# EAGLE design HumidityModule (EAGLE 5.10)
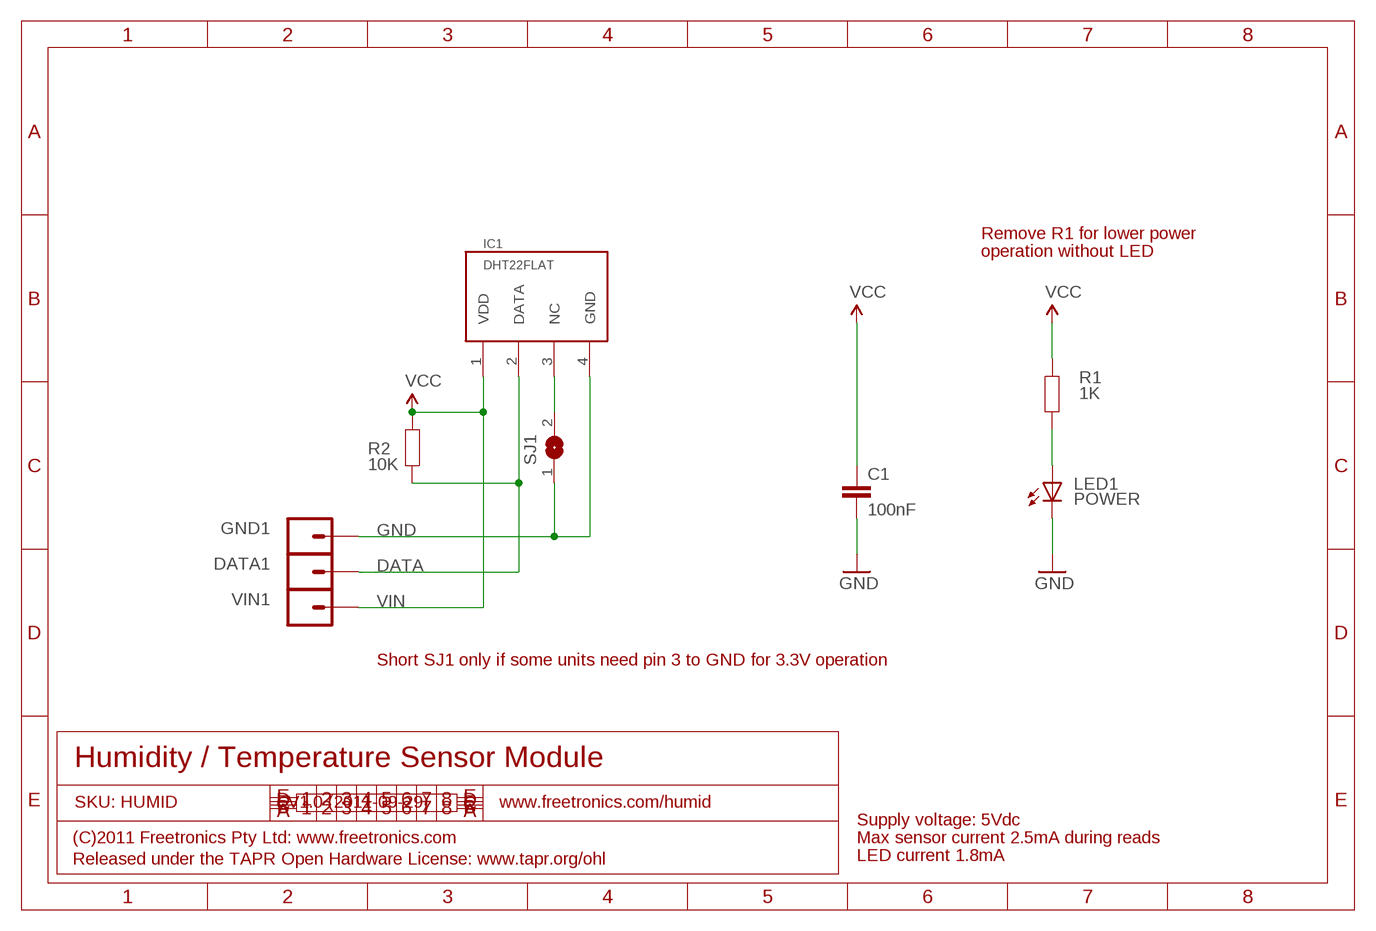
[diagram p0: schematic, sheet 1]

## Parts
C1  100nF  CAP0603  [0603]
DATA1  M01PTH  [1X01]
GND1  M01PTH  [1X01]
IC1  DHT22FLAT  [DHT22]
LED1  POWER  LED0603  [LED-0603]
R1  1K  RESISTOR0603  [0603]
R2  10K  RESISTOR0603  [0603]
SJ1  SJ  [SJ]
VIN1  M01PTH  [1X01]

## Nets
DATA: DATA1.1 IC1.2(DATA) R2.2
GND: C1.2 GND1.1 IC1.4(GND) LED1.C SJ1.1
N$1: LED1.A R1.1
N$2: IC1.3(NC) SJ1.2
VIN: C1.1 IC1.1(VDD) R1.2 R2.1 VIN1.1 ; supply symbol labelled VCC

## Notes on the sheet
- Remove R1 for lower power
- operation without LED
- Short SJ1 only if some units need pin 3 to GND for 3.3V operation
- Humidity / Temperature Sensor Module
- SKU: HUMID | V1.0 (2011-09-29) | www.freetronics.com/humid
- Supply voltage: 5Vdc
- (C)2011 Freetronics Pty Ltd: www.freetronics.com | Max sensor current 2.5mA during reads
- Released under the TAPR Open Hardware License: www.tapr.org/ohl | LED current 1.8mA

## Library data of the parts
C1 = freetronics-master-v1:CAP: Capacitor Standard 0603 ceramic capacitor, and 0.1" leaded capacitor.
DATA1 GND1 VIN1 = freetronics-master-v1:M01: Header 1 Standard 1-pin 0.1" header. Use with straight break away headers (SKU : PRT-00116), right angle break away headers (PRT-00553), swiss pins (PRT-00743), machine pins (PRT-00117), and female headers (PRT-00115).
IC1 = freetronics-jon:DHT22
LED1 = freetronics-marc:LED: LEDs Standard schematic elements and footprints for 5mm, 3mm, 1206, and 0603 sized LEDs. 5mm - Spark Fun Electronics SKU : COM-00529 (and others)
R1 R2 = freetronics-master-v1:RESISTOR: Resistor Basic schematic elements and footprints for 0603, 1206, and PTH 1/10th watt (small) resistors.
SJ1 = freetronics-master-v1:SJ: SMD solder JUMPER

## Board
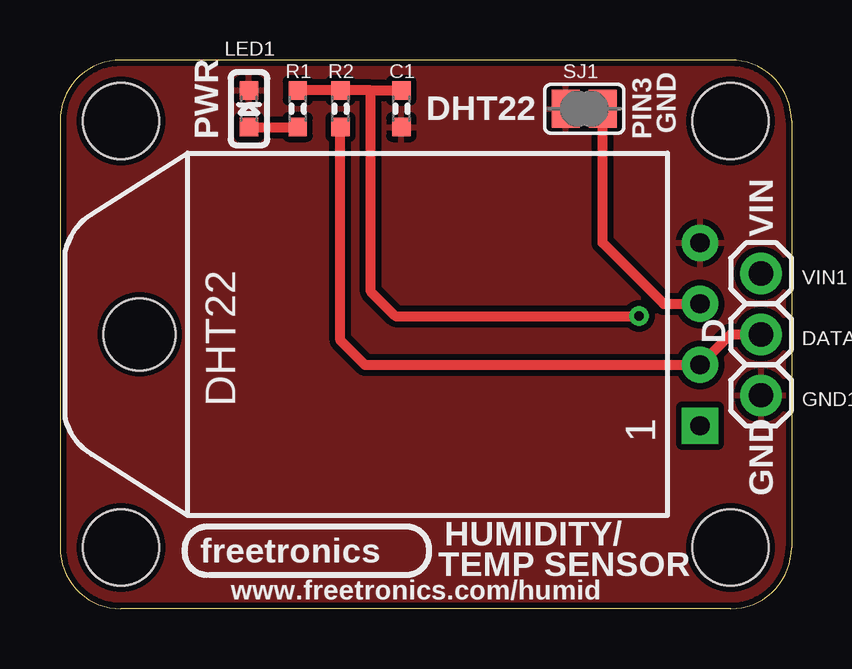
[diagram p1: board, top side]
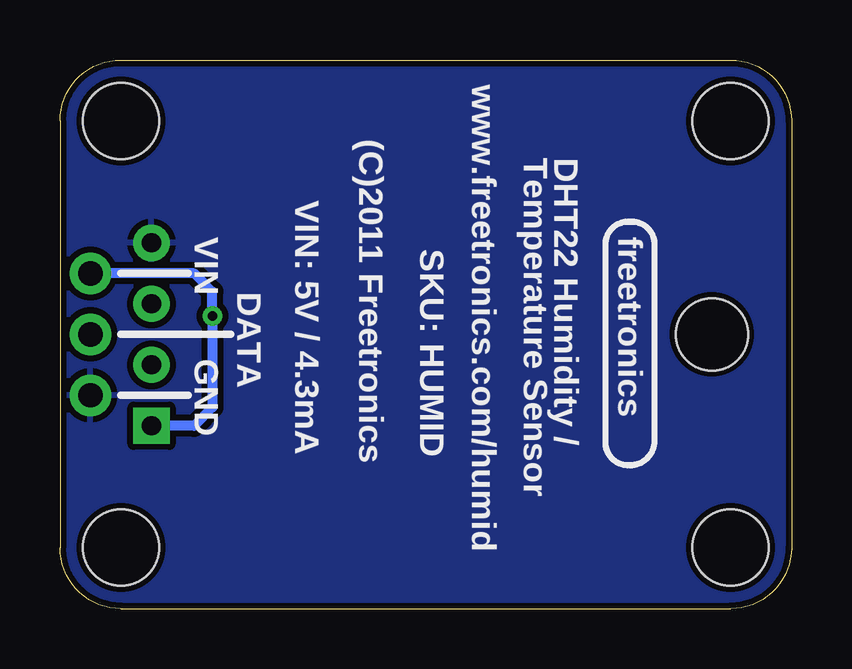
[diagram p2: board, bottom side, seen from below]

Size 30.48 x 22.86 mm. Coordinates in mm from the lower left corner, seen from the top.
Outline: 2.54,22.86 arc90 0,20.32 0,2.54 arc90 2.54,0 27.94,0 arc90 30.48,2.54 30.48,20.32 arc90 27.94,22.86 2.54,22.86
Copper layers (1*16): Top 0.035mm / dielectric 1.5mm / Bottom 0.035mm
Design rules "default *": minimum track width 8mil, minimum drill 15mil, track to track 10mil, track to pad 10mil, pad to pad 10mil, via to via 10mil, smd to smd 8mil, copper to edge 10mil, drill to drill 8mil, minimum pad ring 14mil, minimum via ring 8mil, stop-mask expansion 4mil, vias tented up to drill 25mil, thermal gap 10mil
Holes 3.17 mm at 2.54,20.32 2.54,2.54 27.94,20.32 27.94,2.54

### Footprints (pad centres in the part's own frame; a part is rotated, then mirrored left to right if it is on the bottom)
0603 = smd 0.762 x 0.762: 1 -0.762,0; 2 0.762,0
1X01 = drill 1.016: 1 0,0
DHT22 = drill 0.8 square: 1 -3.81,-6.35 | drill 0.8: 2 -1.27,-6.35; 3 1.27,-6.35; 4 3.81,-6.35 | hole 3: 0,17
LED-0603 = smd 0.762 x 0.762: A -0.762,0; C 0.762,0
SJ = smd 1.168 x 1.6: 1 -0.762,0; 2 0.762,0

### Placement (x,y rotation side)
C1  14.22,20.83 270 top
DATA1  29.21,11.43 270 top
GND1  29.21,8.89 270 top
IC1  20.32,11.43 90 top
LED1  7.87,20.83 90 top
R1  9.91,20.83 90 top
R2  11.68,20.83 270 top
SJ1  21.84,20.83 0 top
VIN1  29.21,13.97 270 top

### Tracks (layer width: path | path; a pad name or v marks a point on that pad's centre or on a via)
DATA
  Top 0.406: R2.2 11.68,11.18 12.7,10.16 IC1.2 27.94,11.43 DATA1.1
GND
  pour Bottom: 30.48,20.32 arc90 27.94,22.86 2.54,22.86 arc90 0,20.32 0,2.54 arc90 2.54,0 27.94,0 arc90 30.48,2.54
  pour Top: 27.94,22.86 2.54,22.86 arc90 0,20.32 0,2.54 arc90 2.54,0 27.94,0 arc90 30.48,2.54 30.48,20.32 arc90
N$1
  Top 0.406: LED1.A R1.1
N$2
  Top 0.406: SJ1.2 22.61,15.24 25.15,12.7 IC1.3
VIN  (via drill 0.4)
  Top 0.406: R1.2 R2.1 12.95,21.59 | 12.95,21.59 C1.1 | 12.95,21.59 12.95,13.21 13.97,12.19 v24.13,12.19
  Bottom 0.406: IC1.1 24.89,7.62 24.13,8.38 v24.13,12.19 24.13,13.21 24.89,13.97 VIN1.1

### Text on the board
tPlace: PWR | DHT22 | PIN3 | GND | VIN | D | GND | HUMIDITY/ | freetronics | TEMP SENSOR | www.freetronics.com/humid
bPlace: www.freetronics.com/humid | (C)2011 Freetronics | DHT22 Humidity / | Temperature Sensor | VIN: 5V / 4.3mA | freetronics | SKU: HUMID | VIN | DATA | GND